# EAGLE design Adafruit ADXL377 (EAGLE 6.3)
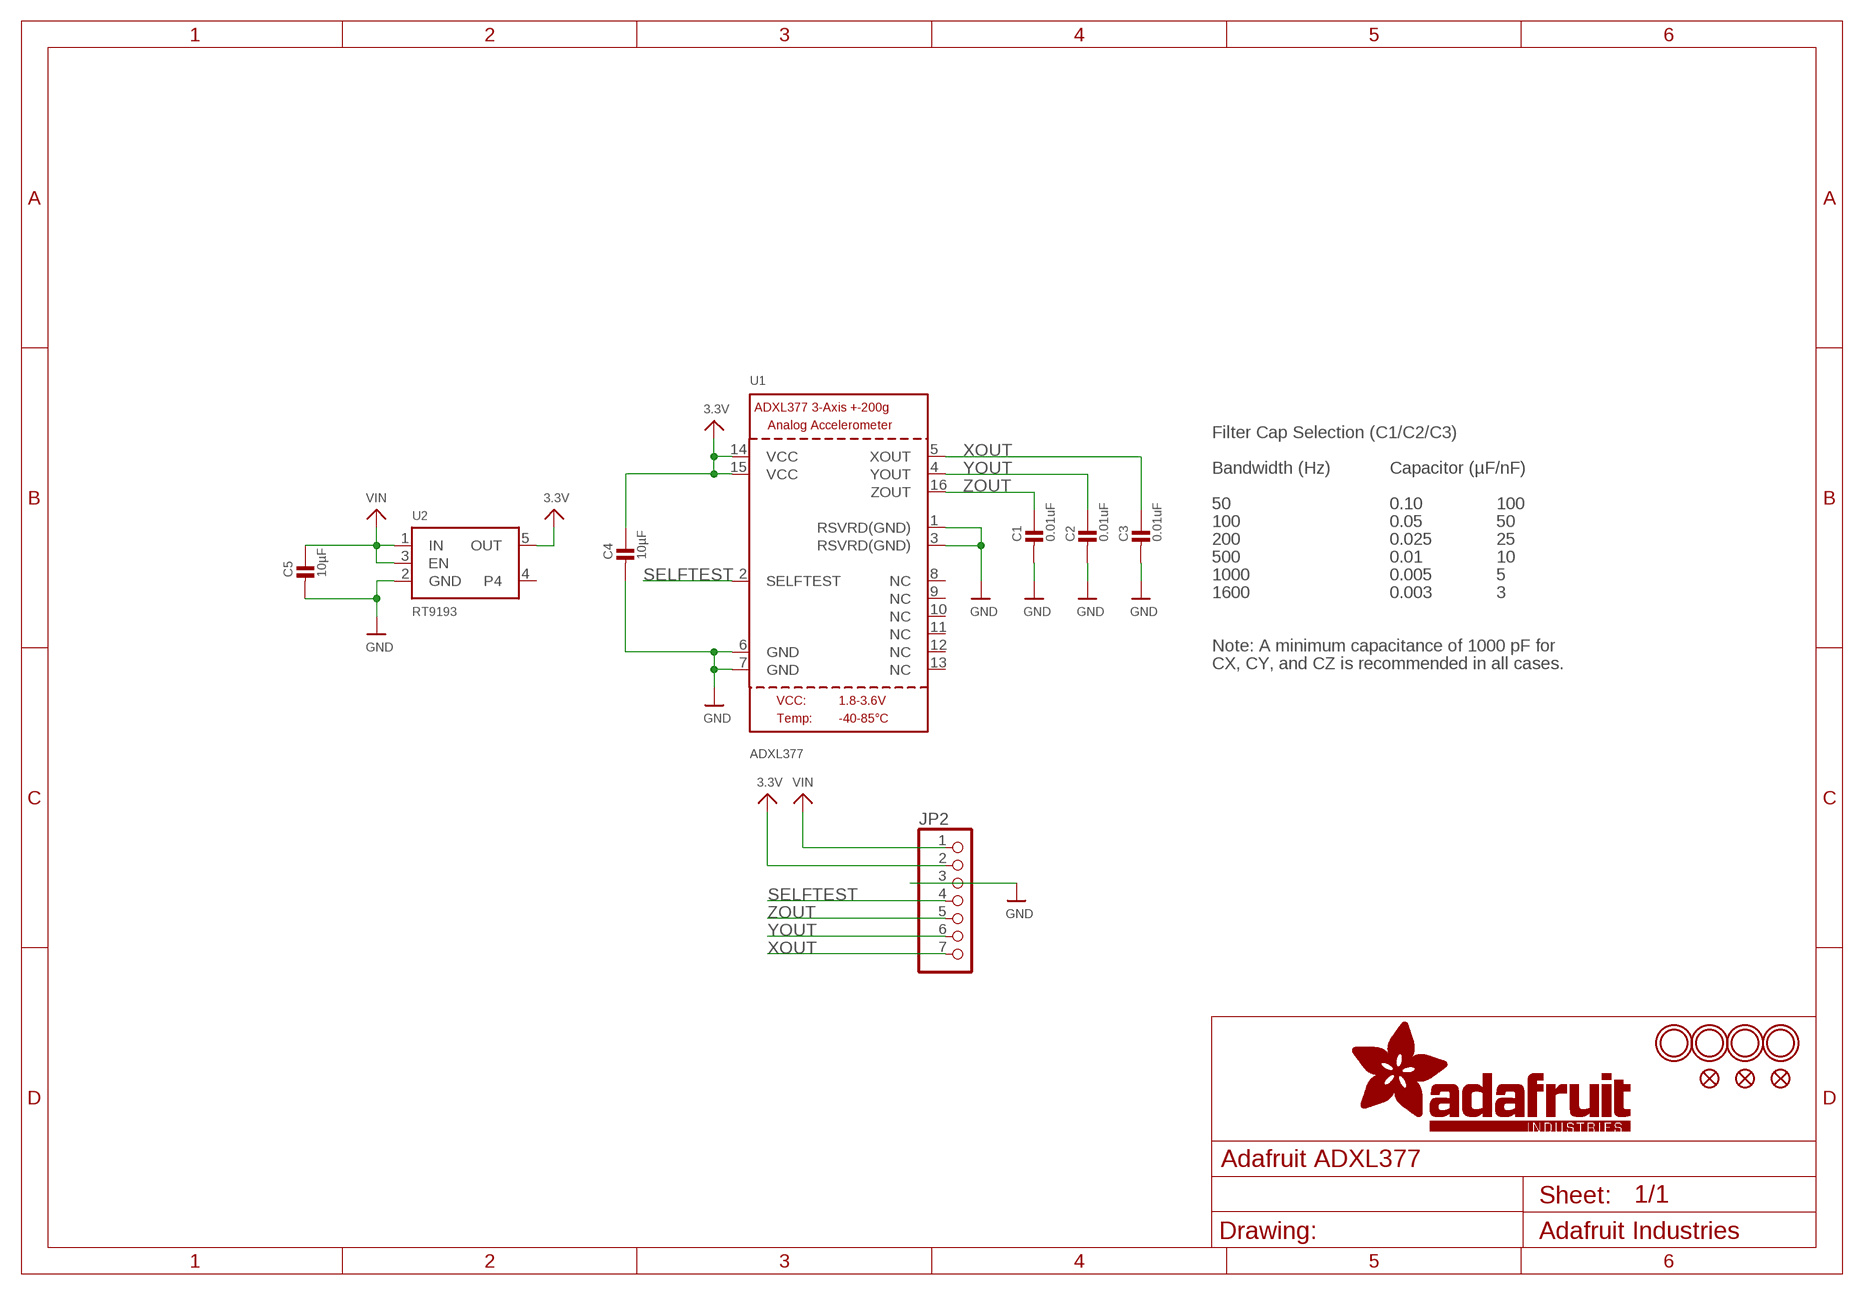
[diagram p0: schematic, sheet 1]

## Parts
C1  0.01uF  CAP_CERAMIC_0805  [_0805]
C2  0.01uF  CAP_CERAMIC_0805  [_0805]
C3  0.01uF  CAP_CERAMIC_0805  [_0805]
C4  10µF  CAP_CERAMIC_0805  [_0805]
C5  10µF  CAP_CERAMIC_0805  [_0805]
FID1  FIDUCIAL""  [FIDUCIAL_1MM]
FID2  FIDUCIAL""  [FIDUCIAL_1MM]
FID3  FIDUCIAL""  [FIDUCIAL_1MM]
JP2  HEADER-1X770MIL  [1X07_ROUND_70]
U1  ADXL377  ACCEL_ADXL377  [LFCSP16_LQ]
U2  RT9193  VREG_SOT23-5  [SOT23-5]
U$2  MOUNTINGHOLE2.5  [MOUNTINGHOLE_2.5_PLATED]
U$3  MOUNTINGHOLE2.5  [MOUNTINGHOLE_2.5_PLATED]
U$17  MOUNTINGHOLE2.5  [MOUNTINGHOLE_2.5_PLATED]
U$18  MOUNTINGHOLE2.5  [MOUNTINGHOLE_2.5_PLATED]

## Nets
3.3V: C4.1 JP2.2 U1.14(VCC) U1.15(VCC) U2.5(OUT)
GND: C1.2 C2.2 C3.2 C4.2 C5.2 JP2.3 U1.1(RSVRD(GND)) U1.3(RSVRD(GND)) U1.6(GND) U1.7(GND) U2.2(GND)
SELFTEST: JP2.4 U1.2(SELFTEST)
VIN: C5.1 JP2.1 U2.1(IN) U2.3(EN)
XOUT: C3.1 JP2.7 U1.5(XOUT)
YOUT: C2.1 JP2.6 U1.4(YOUT)
ZOUT: C1.1 JP2.5 U1.16(ZOUT)
Unconnected: U1.8(NC) U1.9(NC) U1.10(NC) U1.11(NC) U1.12(NC) U1.13(NC) U2.4

## Notes on the sheet
- Filter Cap Selection (C1/C2/C3)
- Bandwidth (Hz) | Capacitor (µF/nF)
- 50 | 0.10 | 100
- 100 | 0.05 | 50
- 200 | 0.025 | 25
- 500 | 0.01 | 10
- 1000 | 0.005 | 5
- 1600 | 0.003 | 3
- Note: A minimum capacitance of 1000 pF for
- CX, CY, and CZ is recommended in all cases.

## Library data of the parts
C1-C5 = microbuilder:CAP_CERAMIC: Ceramic Capacitors For new designs, use the packages preceded by an '_' character since they are more reliable: The following footprints should be used on most boards: _0402 - Standard footprint for regular board layouts _0603 - Standard footprint for regular board layouts _0805 - Standard footprint for regular board layouts For extremely tight-pitch boards where space is at a premium, the following 'micro-pitch' footprints can be used (smaller pads, no silkscreen outline, etc.): _0402MP - Micro-pitch footprint for very dense/compact boards _0603MP - Micro-pitch footprint for very dense/compact boards _0805MP - Micro-pitch footprint for very dense/compact boards Commonly Stocked Parts 0402 - 0402 Surface Mount Capacitors 16pF 50V 5% [Digikey: 445-4899-2-ND] 18pF 50V 5% [Digikey: 490-1281-2-ND] 22pF 50V 5% [Digikey: 490-1283-2-ND] 68pF 50V 5% [Digikey: 490-1289-2-ND] 0.1uF 10V 10% [Digikey: 490-1318-2-ND] 1.0uF 6.3V 10% [Digikey: 490-1320-2-ND] 0603 - 0603 Surface Mount Capacitors 16 pF 50V 5% [Digikey: 445-5051-2-ND] 22 pF 50V [Digikey: PCC220ACVTR-ND] 33 pF 50V 5% [Digikey: 490-1415-1-ND] 56pF 50V 5% [Digikey: 490-1421-1-ND] 220pF 50V 5% [Digikey: 445-1285-1-ND] 680 pF 50V 2200 pF 50V 5% C0G [Digikey: 445-1297-1-ND] 5600 pF 100V 5% X7R [Digikey: 478-3711-1-ND] 0.1 µF 25V 10% [Digikey: PCC2277TR-ND] 0.22 µF 16V 10% X7R [Digikey: 445-1318-1-ND] 1.0 µF 25V 10% [Digikey: 445-5146-2-ND] 0603 - RF Specific 3pF 250V +/-0.1pF RF [Digikey: 712-1347-1-ND] 18 pF 250V 5% [Digikey: 478-3505-1-ND or 712-1322-1-ND] 56 pF 250V 5% C0G RF [Digikey: 490-4867-1-ND] 68 pF 250V RF [Digikey: 490-4868-1-ND] 0805 - 0805 Surface Mount Capacitors 220 pF 250V 2% RF Ceramic Capacitor [Digikey: 712-1398-1-ND] 1000 pF 50V 2% NP0 Ceramic Capacitor [Digikey: 478-3760-1-ND] 0.1 µF 25V 10% Ceramic Capacitor [Digikey: PCC1828TR-ND] 1.0 µF 16V 10% Ceramic Capacitor[Digikey: 490-1691-2-ND] 10.0 µF 10V 10% Ceramic Capacitor[Digikey: 709-1228-1-ND] 10.0 uF 16V 10% Ceramic Capacitor [Digikey: 478-5165-2-ND] 47 uF 6.3V 20% Ceramic Capacitor [Digikey: 587-1779-1-ND or 399-5506-1-ND] 1206 - 1206 Surface Mount Capacitors 47uF 10V 20% Ceramic Capacitor [Digikey: 490-5528-1-ND or 399-5508-1-ND or 445-6010-1-ND] 100uF 6.3V -20%, +80% Y5V Ceramic Capacitor (Digikey: 490-4512-1-ND, Mouser: 81-GRM31CF50J107ZE1L)
FID1-FID3 = microbuilder:FIDUCIAL: Fiducial Alignment Points Various fiducial points for machine vision alignment.
JP2 = microbuilder:HEADER-1X7: PIN HEADER
U1 = microbuilder:ACCEL_ADXL377: ADXL377 +/-200g 3-Axis Analog Accelerometer VCC: 1.8-3.6V
U2 = microbuilder:VREG_SOT23-5: SOT23-5 Fixed Voltage Regulators Part Current Out V Out V In V Dropout θJA (°C/W) TJ (°C) Digikey Part No. ADP121 150mA 3.3V 3.4-5.5V 0.09V @ 150mA -- -- ADP121-AUJZ33R7CT-ND ADP121 150mA 3.0V 3.1-5.5V 0.09V @ 150mA -- -- ADP121-AUJZ30R7CT-ND ADP122 300mA 3.3V 3.4-5.5V 0.085V @ 300mA -- -- ADP122AUJZ-3.3-R7CT-ND ADP1712 300mA 3.3V 3.5-5.5V 0.17V @ 300mA -- -- ADP1712AUJZ-3.3-R7TR-ND AP7311 (Low Cost) 150mA 3.3V 3.5-6V 0.15V @ 150mA -- -- AP7311-33WG-7DICT-ND LD39015M18R 150mA 1.8V 1.9V-5.5V 0.08V @ 100mA -- -- 497-6977-1-ND LP2985A-33DBVR 150mA 3.3V 3.3-16V 0.28V @ 150mA 206 150 296-18479-1-ND MCP1824T-3302E/OT 300mA 3.3V 3.5V-6V 0.2V @ 300mA -- -- MCP1824T-3302E/OTCT-ND MIC5205-2.5YM5 TR 150mA 2.5V 2.7-16V 0.165V @ 150mA -- -- 576-1257-2-ND MIC5205-3.0YM5 TR 150mA 3.0V 3.2V-16V 0.165V @ 150mA -- -- 576-1258-2-ND MIC5205-3.3YM5 TR 150mA 3.3V 3.5V-16V 0.165V @ 150mA -- -- 576-1259-2-ND TPS780330220 150mA 3.3V+2.2V 3.6-5.5V 250mV Max -- -- 296-23332-1-ND TDA3663/N1,135 100mA 3.3V 3.5-45V 0.18V @ 50mA -- -- 568-5343-1-ND Max operating temp can be calculated using θJA, TJ (max junction temperature), and power in watts. Set the "Maximum Ambient Temperature" until it reaches TJ ("Max Junction Temperature"), which is the absolute limit for safe use of the regulator: Heat Sink Temperature Calculator <http://www.daycounter.com/Calculators/Heat-Sink-Temperature-Calculator.phtml> For example, With 12V source into a 3.3V LP2985 and a 30mA load, we are dissipating (12V-3.3V) * 0.03A = 0.261W. With a θJA of 206 °C/W, a TJ of 150°C, and 261mW we can safely use the chip without a heat sink up to 75°C (=147.1°C Junction Temperature).
U$2 U$3 U$17 U$18 = microbuilder:MOUNTINGHOLE: Mounting Hole For #2 screws (0.086"/2.18mm width, 0.094"/2.4mm hole) use 2.5mm

## Board
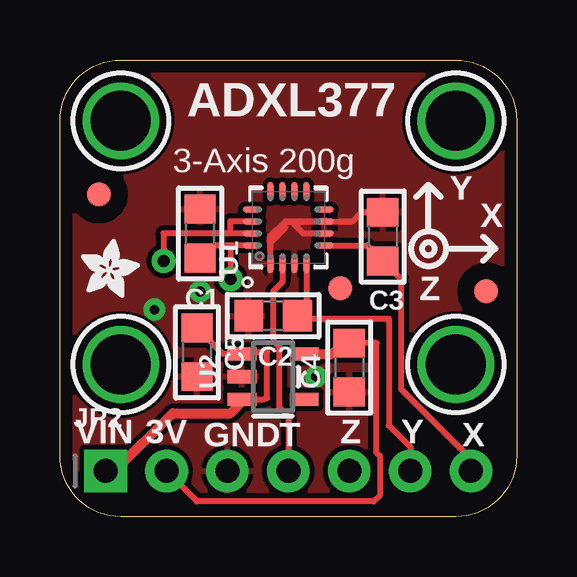
[diagram p1: board, top side]
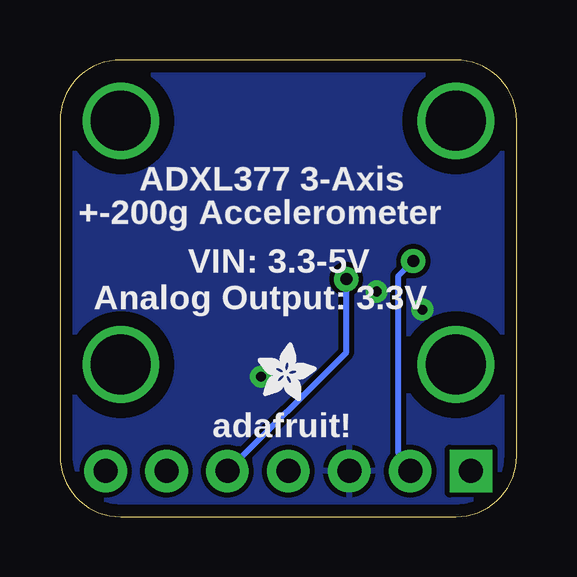
[diagram p2: board, bottom side, seen from below]

Size 19.05 x 19.05 mm. Coordinates in mm from the lower left corner, seen from the top.
Outline: 19.05,16.51 19.05,2.54 arc-90 16.51,0 2.54,0 arc-90 0,2.54 0,16.51 arc-90 2.54,19.05 16.51,19.05 arc-90 19.05,16.51
Copper layers (1*16): Top 0.035mm / dielectric 1.5mm / Bottom 0.035mm
Design rules "default": minimum track width 8mil, minimum drill 0.4mm, track to track 8mil, track to pad 8mil, pad to pad 8mil, via to via 8mil, smd to smd 8mil, copper to edge 20mil, drill to drill 8mil, minimum pad ring 8mil, minimum via ring 10mil, stop-mask expansion 3mil, vias tented up to drill 20mil, thermal gap 8mil
tRestrict: area 12.4,25.5 to 12.8,25.6; area 10.1,23.1 to 10.5,23.5; area 11.2,23.1 to 11.5,23.5; area 9.6,24 to 10,24.4

### Footprints (pad centres in the part's own frame; a part is rotated, then mirrored left to right if it is on the bottom)
_0805 = smd 1.2 x 1.3: 1 -1.016,0; 2 1.016,0
FIDUCIAL_1MM = smd 1 x 1: 1 0,0
1X07_ROUND_70 = drill 1 pad 1.778 square: 1 -7.62,0 | drill 1 pad 1.778: 2 -5.08,0; 3 -2.54,0; 4 0,0; 5 2.54,0; 6 5.08,0; 7 7.62,0
LFCSP16_LQ = smd 0.8 x 0.25: 1 -1.5,0.75; 2 -1.5,0.25; 3 -1.5,-0.25; 4 -1.5,-0.75; 9 1.5,-0.75; 10 1.5,-0.25; 11 1.5,0.25; 12 1.5,0.75 | smd 0.25 x 0.8: 5 -0.75,-1.5; 6 -0.25,-1.5; 7 0.25,-1.5; 8 0.75,-1.5; 13 0.75,1.5; 14 0.25,1.5; 15 -0.25,1.5; 16 -0.75,1.5
SOT23-5 = smd 0.55 x 1.2: 1 -0.95,-1.3; 2 0,-1.3; 3 0.95,-1.3; 4 0.95,1.3; 5 -0.95,1.3
MOUNTINGHOLE_2.5_PLATED = drill 2.5 pad 3.2: P$1 0,0

### Placement (x,y rotation side)
C1  5.84,11.81 90 top
C2  8.89,8.38 180 top
C3  13.46,11.68 90 top
C4  12.06,6.22 270 top
C5  5.71,6.86 270 top
FID1  1.63,13.44 0 top
FID2  17.78,9.4 0 top
FID3  11.68,9.53 0 top
JP2  9.53,1.91 0 top
U1  9.53,12.07 90 top
U2  8.89,5.84 270 top
U$2  16.51,16.51 0 top
U$3  2.54,16.51 0 top
U$16  [ADAFRUIT_2.5MM]  0.89,9.14 0 top
U$17  2.54,6.35 0 top
U$18  16.51,6.35 0 top
U$19  [ADAFRUIT_2.5MM]  10.79,4.83 0 bottom

### Tracks (layer width: path | path; a pad name or v marks a point on that pad's centre or on a via)
3.3V  (via drill 0.5)
  Top 0.254: U1.14 7.11,12.31 7.11,11.81 U1.15 4.32,11.81 v4.32,10.67 | C4.1 13.21,7.24 13.21,2.67 13.33,2.54 13.33,0.89 13.08,0.63 5.71,0.63 JP2.2
  Top 0.406: U2.5 11.36,6.79 12.19,7.62 C4.1
  Bottom 0.254: v4.32,10.67 4.95,10.03 4.95,2.67 4.44,2.16 JP2.2
GND  (via drill 0.41)
  Top 0.254: U1.6 10.16,11.81 9.84,12.13 | 9.84,12.13 9.78,12.19 | U1.7 10.03,12.31 9.84,12.13 | 9.4,12.06 8.77,11.44 U1.1 8.77,11.7 9.4,12.32 12.19,12.32 12.57,12.7 C3.2
  other vias: 10.67,5.84 3.94,8.64 5.84,9.4
  pour Top (isolate 0.203): 0,19.05 19.05,19.05 19.05,0 0,0
  pour Bottom (isolate 0.203): 0,19.05 19.05,19.05 19.05,0 0,0
SELFTEST
  Top 0.254: U1.2 9.27,9.78 8.89,9.4 8.89,7.37 9.14,7.11 9.14,4.57 9.52,4.19 JP2.4
VIN
  Top 0.254: U2.3 8.45,4.89 8.64,4.95 8.64,6.86 8.16,6.86 | 8.13,6.86 8.16,6.86 | 8.16,6.86 U2.1 6.8,6.79 C5.1
  Top 0.406: U2.3 7.69,4.89 7.11,4.32 4.7,4.32 2.29,1.9 JP2.1
XOUT
  Top 0.254: U1.5 12.81,11.31 C3.1 14.22,9.91 14.22,5.33 17.14,2.41 JP2.7
YOUT
  Top 0.254: U1.4 10.27,8.27 | 10.27,8.27 C2.1 | 10.27,8.27 13.72,8.27 13.72,3.81 14.6,2.92 JP2.6
ZOUT  (via drill 0.5)
  Top 0.254: C1.1 6.49,11.31 U1.16 7.11,11.31 v7.11,9.91
  Bottom 0.254: JP2.5 7.11,6.86 v7.11,9.91

### Text on the board
tPlace: ADXL377 | 3-Axis 200g | Y | X | Z | VIN | 3V | Z | Y | GND | T | X
bPlace: ADXL377 3-Axis | +-200g Accelerometer | VIN: 3.3-5V | Analog Output: 3.3V | adafruit!